# EAGLE design LoRa Shield (EAGLE 9.5.1)
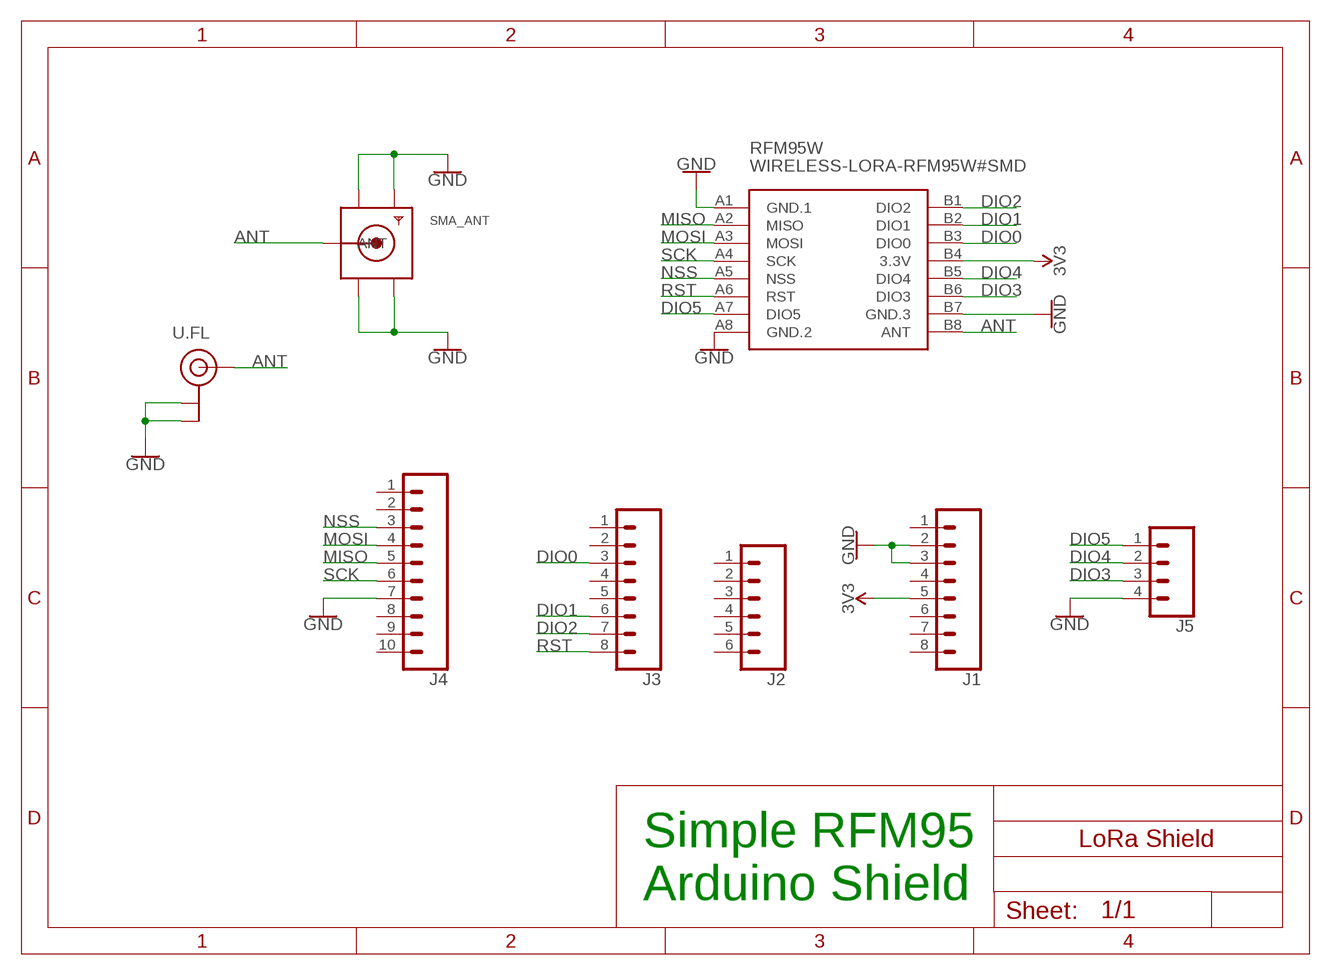
[diagram p0: schematic, sheet 1]

## Parts
J1  CONN_08"  [1X08]
J2  CONN_06SILK_FEMALE_PTH  [1X06]
J3  CONN_08"  [1X08]
J4  CONN_10"  [1X10]
J5  CONN_04PTH  [1X04]
RFM95W  WIRELESS-LORA-RFM95W#SMD  [WIRELESS-LORA-RFM95W#SMD]
SMA_ANT  SMACONNECTOR  [SMA90_DIP]
U.FL  U.FL  [U.FL]

## Nets
ANT: RFM95W.B8(ANT) SMA_ANT.ANTENNA(ANT) U.FL.FEED(SIGNAL)
DIO0: J3.3 RFM95W.B3(DIO0)
DIO1: J3.6 RFM95W.B2(DIO1)
DIO2: J3.7 RFM95W.B1(DIO2)
DIO3: J5.3 RFM95W.B6(DIO3)
DIO4: J5.2 RFM95W.B5(DIO4)
DIO5: J5.1 RFM95W.A7(DIO5)
GND: J1.2 J1.3 J4.7 J5.4 RFM95W.A1(GND.1) RFM95W.A8(GND.2) RFM95W.B7(GND.3) SMA_ANT.GND1 SMA_ANT.GND2 SMA_ANT.GND3 SMA_ANT.GND4 U.FL.1(GND) U.FL.2(GND)
MISO: J4.5 RFM95W.A2(MISO)
MOSI: J4.4 RFM95W.A3(MOSI)
NSS: J4.3 RFM95W.A5(NSS)
RST: J3.8 RFM95W.A6(RST)
SCK: J4.6 RFM95W.A4(SCK)
VCC: J1.5 RFM95W.B4(3.3V) ; supply symbol labelled 3V3
Unconnected: J1.1 J1.4 J1.6 J1.7 J1.8 J2.1 J2.2 J2.3 J2.4 J2.5 J2.6 J3.1 J3.2 J3.4 J3.5 J4.1 J4.2 J4.8 J4.9 J4.10

## Notes on the sheet
- Simple RFM95
  Arduino Shield

## Library data of the parts
J1 J3 = SparkFun-Connectors:CONN_08: Multi connection point. Often used as Generic Header-pin footprint for 0.1 inch spaced/style header connections On any of the 0.1 inch spaced packages, you can populate with these: Break Away Headers - Straight <https://www.sparkfun.com/products/116> (PRT-00116) Break Away Male Headers - Right Angle <https://www.sparkfun.com/products/553> (PRT-00553) Female Headers <https://www.sparkfun.com/products/115> (PRT-00115) Break Away Headers - Machine Pin <https://www.sparkfun.com/products/117> (PRT-00117) Break Away Female Headers - Swiss Machine Pin <https://www.sparkfun.com/products/743> (PRT-00743) Arduino Stackable Header - 8 Pin <https://www.sparkfun.com/products/9279> (PRT-09279) For SCREWTERMINALS and SPRING TERMINALS visit here: Screw Terimnals on SparkFun.com <https://www.sparkfun.com/search/results?term=Screw+Terminals> (5mm/3.5mm/2.54mm spacing) This device is also useful as a general connection point to wire up your design to another part of your project. Our various solder wires solder well into these plated through hole pads. Hook-Up Wire - Assortment (Stranded, 22 AWG) <https://www.sparkfun.com/products/11375> (PRT-11375) Hook-Up Wire - Assortment (Solid Core, 22 AWG) <https://www.sparkfun.com/products/11367> (PRT-11367) View the entire wire category on our website here <https://www.sparkfun.com/categories/141> Special notes: Molex polarized connector foot print use with SKU : PRT-08231 with associated crimp pins and housings. 1MM SMD Version SKU: PRT-10208 NOTES ON THE VARIANTS LOCK and LOCK_LONGPADS... This footprint was designed to help hold the alignment of a through-hole component (i.e. 6-pin header) while soldering it into place. You may notice that each hole has been shifted either up or down by 0.005 of an inch from it's more standard position (which is a perfectly straight line). This slight alteration caused the pins (the squares in the middle) to touch the edges of the holes. Because they are alternating, it causes a "brace" to hold the component in place. 0.005 has proven to be the perfect amount of "off-center" position when using our standard breakaway headers. Although looks a little odd when you look at the bare footprint, once you have a header in there, the alteration is very hard to notice. Also,if you push a header all the way into place, it is covered up entirely on the bottom side.; PROD_ID: CONN-08438
J2 = SparkFun-Connectors:CONN_06: Multi connection point. Often used as Generic Header-pin footprint for 0.1 inch spaced/style header connections On any of the 0.1 inch spaced packages, you can populate with these: Break Away Headers - Straight <https://www.sparkfun.com/products/116> (PRT-00116) Break Away Male Headers - Right Angle <https://www.sparkfun.com/products/553> (PRT-00553) Female Headers <https://www.sparkfun.com/products/115> (PRT-00115) Break Away Headers - Machine Pin <https://www.sparkfun.com/products/117> (PRT-00117) Break Away Female Headers - Swiss Machine Pin <https://www.sparkfun.com/products/743> (PRT-00743) Arduino Stackable Header - 6 Pin <https://www.sparkfun.com/products/9280> (PRT-09280) For SCREWTERMINALS and SPRING TERMINALS visit here: Screw Terimnals on SparkFun.com <https://www.sparkfun.com/search/results?term=Screw+Terminals> (5mm/3.5mm/2.54mm spacing) This device is also useful as a general connection point to wire up your design to another part of your project. Our various solder wires solder well into these plated through hole pads. Hook-Up Wire - Assortment (Stranded, 22 AWG) <https://www.sparkfun.com/products/11375> (PRT-11375) Hook-Up Wire - Assortment (Solid Core, 22 AWG) <https://www.sparkfun.com/products/11367> (PRT-11367) View the entire wire category on our website here <https://www.sparkfun.com/categories/141>; PROD_ID: CONN-08437
J4 = SparkFun-Connectors:CONN_10: Multi connection point. Often used as Generic Header-pin footprint for 0.1 inch spaced/style header connections On any of the 0.1 inch spaced packages, you can populate with these: Break Away Headers - Straight <https://www.sparkfun.com/products/116> (PRT-00116) Break Away Male Headers - Right Angle <https://www.sparkfun.com/products/553> (PRT-00553) Female Headers <https://www.sparkfun.com/products/115> (PRT-00115) Break Away Headers - Machine Pin <https://www.sparkfun.com/products/117> (PRT-00117) Break Away Female Headers - Swiss Machine Pin <https://www.sparkfun.com/products/743> (PRT-00743) Arduino Stackable Header - 10 Pin <https://www.sparkfun.com/products/11376> (PRT-11376) For SCREWTERMINALS and SPRING TERMINALS visit here: Screw Terimnals on SparkFun.com <https://www.sparkfun.com/search/results?term=Screw+Terminals> (5mm/3.5mm/2.54mm spacing) This device is also useful as a general connection point to wire up your design to another part of your project. Our various solder wires solder well into these plated through hole pads. Hook-Up Wire - Assortment (Stranded, 22 AWG) <https://www.sparkfun.com/products/11375> (PRT-11375) Hook-Up Wire - Assortment (Solid Core, 22 AWG) <https://www.sparkfun.com/products/11367> (PRT-11367) View the entire wire category on our website here <https://www.sparkfun.com/categories/141> Special notes: Molex polarized connector foot print use with SKU : PRT-08231 with associated crimp pins and housings. 1MM SMD Version SKU: PRT-10208 NOTES ON THE VARIANTS LOCK and LOCK_LONGPADS... This footprint was designed to help hold the alignment of a through-hole component (i.e. 6-pin header) while soldering it into place. You may notice that each hole has been shifted either up or down by 0.005 of an inch from it's more standard position (which is a perfectly straight line). This slight alteration caused the pins (the squares in the middle) to touch the edges of the holes. Because they are alternating, it causes a "brace" to hold the component in place. 0.005 has proven to be the perfect amount of "off-center" position when using our standard breakaway headers. Although looks a little odd when you look at the bare footprint, once you have a header in there, the alteration is very hard to notice. Also,if you push a header all the way into place, it is covered up entirely on the bottom side.; PROD_ID: CONN-11563
J5 = SparkFun-Connectors:CONN_04: Multi connection point. Often used as Generic Header-pin footprint for 0.1 inch spaced/style header connections On any of the 0.1 inch spaced packages, you can populate with these: Break Away Headers - Straight <https://www.sparkfun.com/products/116> (PRT-00116) Break Away Male Headers - Right Angle <https://www.sparkfun.com/products/553> (PRT-00553) Female Headers <https://www.sparkfun.com/products/115> (PRT-00115) Break Away Headers - Machine Pin <https://www.sparkfun.com/products/117> (PRT-00117) Break Away Female Headers - Swiss Machine Pin <https://www.sparkfun.com/products/743> (PRT-00743) For SCREWTERMINALS and SPRING TERMINALS visit here: Screw Terimnals on SparkFun.com <https://www.sparkfun.com/search/results?term=Screw+Terminals> (5mm/3.5mm/2.54mm spacing) This device is also useful as a general connection point to wire up your design to another part of your project. Our various solder wires solder well into these plated through hole pads. Hook-Up Wire - Assortment (Stranded, 22 AWG) <https://www.sparkfun.com/products/11375> (PRT-11375) Hook-Up Wire - Assortment (Solid Core, 22 AWG) <https://www.sparkfun.com/products/11367> (PRT-11367) View the entire wire category on our website here <https://www.sparkfun.com/categories/141> Special notes: Molex polarized connector foot print use with SKU : PRT-08231 with associated crimp pins and housings. 1MM SMD Version SKU: PRT-10208; PROD_ID: CONN-09696
RFM95W = diy-modules:WIRELESS-LORA-RFM95W: 868/915 MHz LoRa Radio Transceiver Module based on SX1276 chip Click here to find device on ebay.com <http://www.ebay.com/sch/RFM95W+transceiver>
SMA_ANT = adafruit:SMACONNECTOR: SMA Connector 90° DIP SMA Connector, 50 Ohm (4UConnector: 07259)
U.FL = SparkFun-Connectors:U.FL: SMD Antenna Connector - U.FL 2mm height, 3.0mm x 3.0mm receptacle size. SparkFun Products: SparkFun WiFi Shield - ESP8266 <https://www.sparkfun.com/products/13287> SparkFun ESP8266 Thing <https://www.sparkfun.com/products/13231> SparkFun MiniGen - Pro Mini Signal Generator Shield <https://www.sparkfun.com/products/11420>; PROD_ID: CONN-09193; SF_ID: WRL-09144

## Net classes
0 default: clearance 0.205 mm

## Board
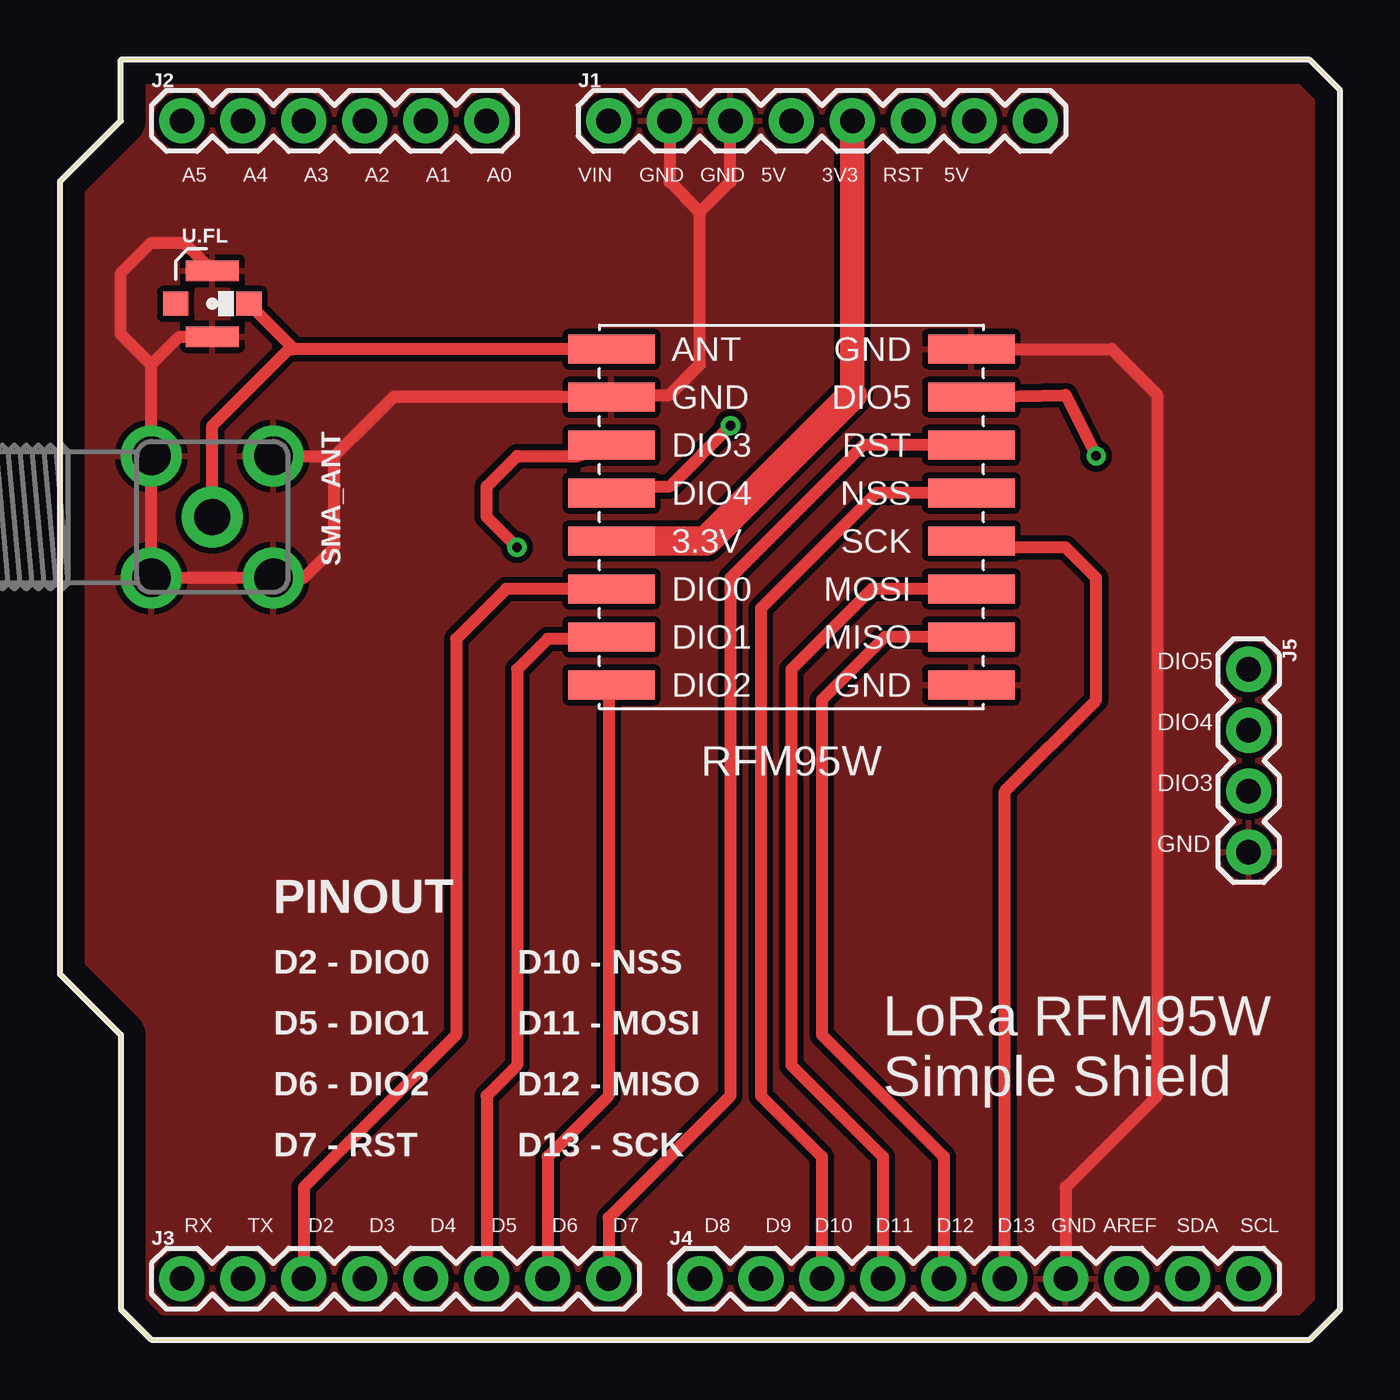
[diagram p1: board, top side]
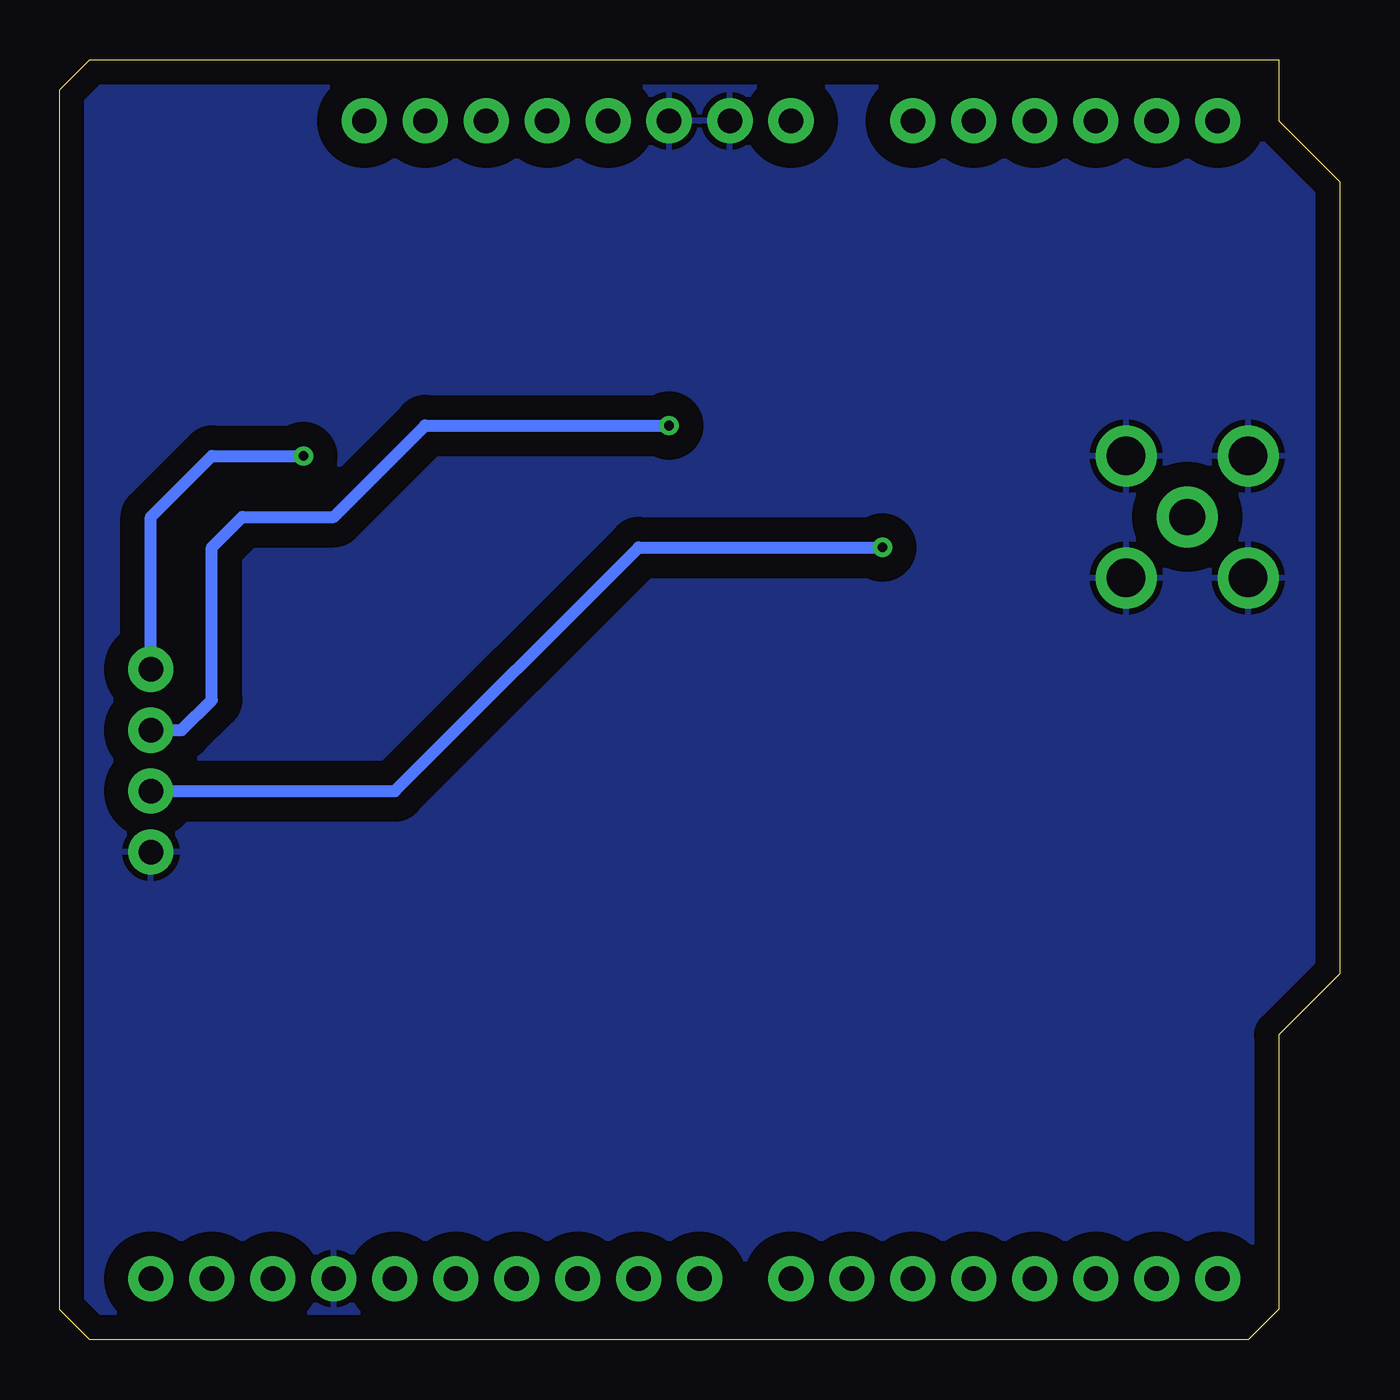
[diagram p2: board, bottom side, seen from below]

Size 53.32 x 53.34 mm. Coordinates in mm from the lower left corner, seen from the top.
Outline: 0,48.26 0,15.24 2.54,12.7 2.54,1.27 3.81,0 52.07,0 53.32,1.25 53.32,52.09 52.07,53.34 2.54,53.34 2.54,50.8 0,48.26
Copper layers (1*16): Top 0.035mm / dielectric 1.5mm / Bottom 0.035mm
Design rules "default *": minimum track width 9mil, minimum drill 0.5mm, track to track 9mil, track to pad 9mil, pad to pad 9mil, via to via 9mil, smd to smd 9mil, copper to edge 40mil, drill to drill 6mil, minimum pad ring 10mil, minimum via ring 8mil, stop-mask expansion 4mil, vias tented up to drill 0mil, thermal gap 10mil

### Footprints (pad centres in the part's own frame; a part is rotated, then mirrored left to right if it is on the bottom)
1X08 = drill 1.016 pad 1.88: 1 0,0; 2 2.54,0; 3 5.08,0; 4 7.62,0; 5 10.16,0; 6 12.7,0; 7 15.24,0; 8 17.78,0
1X06 = drill 1.016 pad 1.88: 1 0,0; 2 2.54,0; 3 5.08,0; 4 7.62,0; 5 10.16,0; 6 12.7,0
1X10 = drill 1.016 pad 1.88: 1 0,0; 2 2.54,0; 3 5.08,0; 4 7.62,0; 5 10.16,0; 6 12.7,0; 7 15.24,0; 8 17.78,0; 9 20.32,0; 10 22.86,0
1X04 = drill 1.016 pad 1.88: 1 0,0; 2 2.54,0; 3 5.08,0; 4 7.62,0
WIRELESS-LORA-RFM95W#SMD = smd 3.6 x 1.2: A1 -7.5,7; A2 -7.5,5; A3 -7.5,3; A4 -7.5,1; A5 -7.5,-1; A6 -7.5,-3; A7 -7.5,-5; A8 -7.5,-7; B1 7.5,7; B2 7.5,5; B3 7.5,3; B4 7.5,1; B5 7.5,-1; B6 7.5,-3; B7 7.5,-5; B8 7.5,-7
SMA90_DIP = drill 1.5 pad 2.54: ANTENNA 0,0 | drill 1.6 pad 2.54: GND1 -2.54,2.54; GND2 2.54,2.54; GND3 -2.54,-2.54; GND4 2.54,-2.54
U.FL = smd 2.2 x 0.85: 1 0,1.375; 2 0,-1.375 | smd 1.05 x 1: FEED 1.525,0; NC -1.525,0

### Placement (x,y rotation side)
J1  22.86,50.8 0 top
J2  5.08,50.8 0 top
J3  5.08,2.54 0 top
J4  26.67,2.54 0 top
J5  49.53,27.94 270 top
RFM95W  30.48,34.29 180 top
SMA_ANT  6.35,34.29 90 top
U.FL  6.35,43.18 0 top

### Tracks (layer width: path | path; a pad name or v marks a point on that pad's centre or on a via)
ANT
  Top 0.508: RFM95W.B8 9.76,41.29 | 9.76,41.29 U.FL.FEED | SMA_ANT.ANTENNA 6.35,38.1 9.54,41.29 9.76,41.29
DIO0
  Top 0.508: RFM95W.B3 18.59,31.29 16.51,29.21 16.51,12.7 10.16,6.35 J3.3
DIO1
  Top 0.508: RFM95W.B2 22.9,29.21 20.32,29.21 19.05,27.94 19.05,11.43 17.78,10.16 J3.6
DIO2
  Top 0.508: RFM95W.B1 22.86,27.17 22.86,10.16 20.32,7.62 J3.7
DIO3  (via drill 0.4)
  Top 0.508: v19.05,33.02 17.78,34.29 17.78,35.56 19.05,36.83 21.59,36.83 RFM95W.B6
  Bottom 0.508: J5.3 39.37,22.86 29.21,33.02 v19.05,33.02
DIO4  (via drill 0.4)
  Top 0.508: v27.94,38.1 25.4,35.56 24.13,35.56 RFM95W.B5
  Bottom 0.508: J5.2 48.26,25.4 46.99,26.67 46.99,33.02 45.72,34.29 41.91,34.29 38.1,38.1 v27.94,38.1
DIO5  (via drill 0.4)
  Top 0.508: RFM95W.A7 41.91,39.37 v43.18,36.83
  Bottom 0.508: J5.1 49.53,34.29 46.99,36.83 v43.18,36.83
GND
  Top 0.508: 11.43,36.83 13.89,39.29 RFM95W.B7 23.06,39.37 25.4,39.37 26.67,40.64 26.67,46.99 | RFM95W.A8 43.83,41.29 45.72,39.4 45.72,10.16 41.91,6.35 J4.7 | 3.81,40.64 SMA_ANT.GND2 SMA_ANT.GND1 SMA_ANT.GND3 10.16,31.75 11.43,33.02 11.43,36.83 | 3.81,40.64 4.98,41.81 U.FL.2 | 3.81,40.64 2.54,41.91 2.54,44.45 3.81,45.72 5.18,45.72 U.FL.1 | SMA_ANT.GND4 11.43,36.83 | J1.2 25.4,48.26 26.67,46.99 | 26.67,46.99 27.94,48.26 J1.3
  pour Top (isolate 0.254): 0,48.26 0,15.24 2.54,12.7 2.54,1.27 3.81,0 52.07,0 53.34,1.27 53.34,52.07 52.07,53.34 2.54,53.34 2.54,50.8
  pour Bottom (isolate 1.016): 2.54,53.34 2.54,50.8 0,48.26 0,15.24 2.54,12.7 2.54,1.27 3.81,0 52.07,0 53.34,1.27 53.34,52.07 52.07,53.34
MISO
  Top 0.508: RFM95W.A2 34.37,29.29 31.75,26.67 31.75,12.7 36.83,7.62 J4.5
MOSI
  Top 0.508: RFM95W.A3 33.83,31.29 30.48,27.94 30.48,11.43 34.29,7.62 J4.4
NSS
  Top 0.508: RFM95W.A5 34.02,35.29 29.21,30.48 29.21,10.16 31.75,7.62 J4.3
RST
  Top 0.508: RFM95W.A6 33.48,37.29 27.94,31.75 27.94,10.16 22.86,5.08 J3.8
SCK
  Top 0.508: J4.6 39.37,22.86 43.18,26.67 43.18,31.75 41.91,33.02 38.25,33.02 RFM95W.A4
VCC
  Top 1.016: J1.5 33.02,39.37
  Top 1.219: RFM95W.B4 26.94,33.29 33.02,39.37

### Text on the board
tNames: A5 | A4 | A3 | A2 | A1 | A0 | VIN | GND | GND | 5V | 3V3 | RST | 5V | DIO5 | DIO4 | DIO3 | GND | PINOUT | D2 - DIO0 | D10 - NSS | D5 - DIO1 | D11 - MOSI | D6 - DIO2 | D12 - MISO | LoRa RFM95W / Simple Shield | D7 - RST | D13 - SCK | RX | TX | D2 | D3 | D4 | D5 | D6 | D7 | D8 | D9 | D10 | D11 | D12 | D13 | GND | AREF | SDA | SCL